# Altium schematic sheet breakbeam-interface.SchDoc
size A4
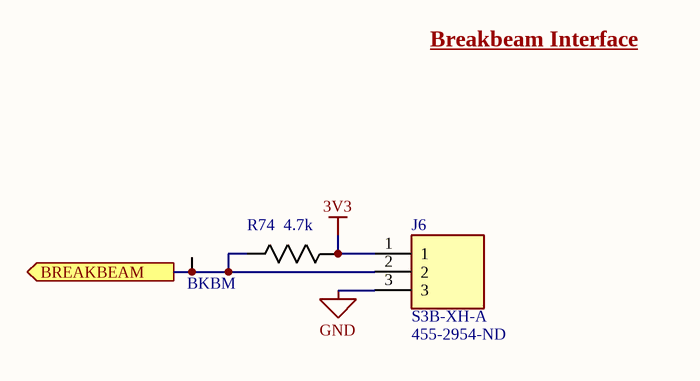
[diagram p0: breakbeam-interface.SchDoc]

## Parts
BKBM  Test Point (Via)  [TP]  (value not drawn)  (no BOM)
J6  S3B-XH-A  Supplier Part Number 1: 455-2954-ND  [JST_S3B-XH-A]
R74  4.7k  [0603]

## Ports
BREAKBEAM (out)

## Nets
3V3: J6.1 R74.1(R1)
GND: J6.3
BREAKBEAM: BKBM.1 J6.2 R74.2(R2) ; port BREAKBEAM

## Notes on the sheet
- Breakbeam Interface

## Library data of the parts
J6 = CN HDR 3POS JST XH RA: Connector Header Through Hole Right Angle 3 position 0.098 (2.50mm); Manufacturer Part Number 1: S3B-XH-A-1(LF)(SN); MF: JST Sales; MP: B3B-XH-A(LF)(SN); Check_prices: https://www.snapeda.com/parts/B3B-XH-A(LF)(SN)/JST%20Sales%20America%20Inc./view-part/231271/?ref=eda; Value: *; Package: None; Price: None; Availability: In Stock; SnapEDA_Link: https://www.snapeda.com/parts/B3B-XH-A(LF)(SN)/JST%20Sales%20America%20Inc./view-part/231271/?ref=snap; Supplier 1: Digi-Key; Part Number: CN HDR 3POS JST XH RA; Supplier URL 1: https://www.digikey.ca/en/products/detail/jst-sales-america-inc/S3B-XH-A-1-LF-SN/1556255; Pin Count: 3
R74 = RES 4.7k 1/8W - 5%: RES SMD 4.7k OHM 5% 1/8W 0603; Manufacturer Part Number 1: RMCF0603JT4K70; Power (Watts): 0.125W; Package: 0805; Value: 4.7k; Tolerance: 5%; Part Number: RES 4.7k 1/8W - 5%; Supplier 1: Digi-Key; Supplier Part Number 1: RMCF0603JT4K70CT-ND; Supplier URL 1: https://www.digikey.ca/en/products/detail/stackpole-electronics-inc/RMCF0603JT4K70/1757976
BKBM = Test Point (Via): Part Number: Test Point (Via)